# EAGLE design MURI_Compass_V3 (EAGLE 9.6.1)
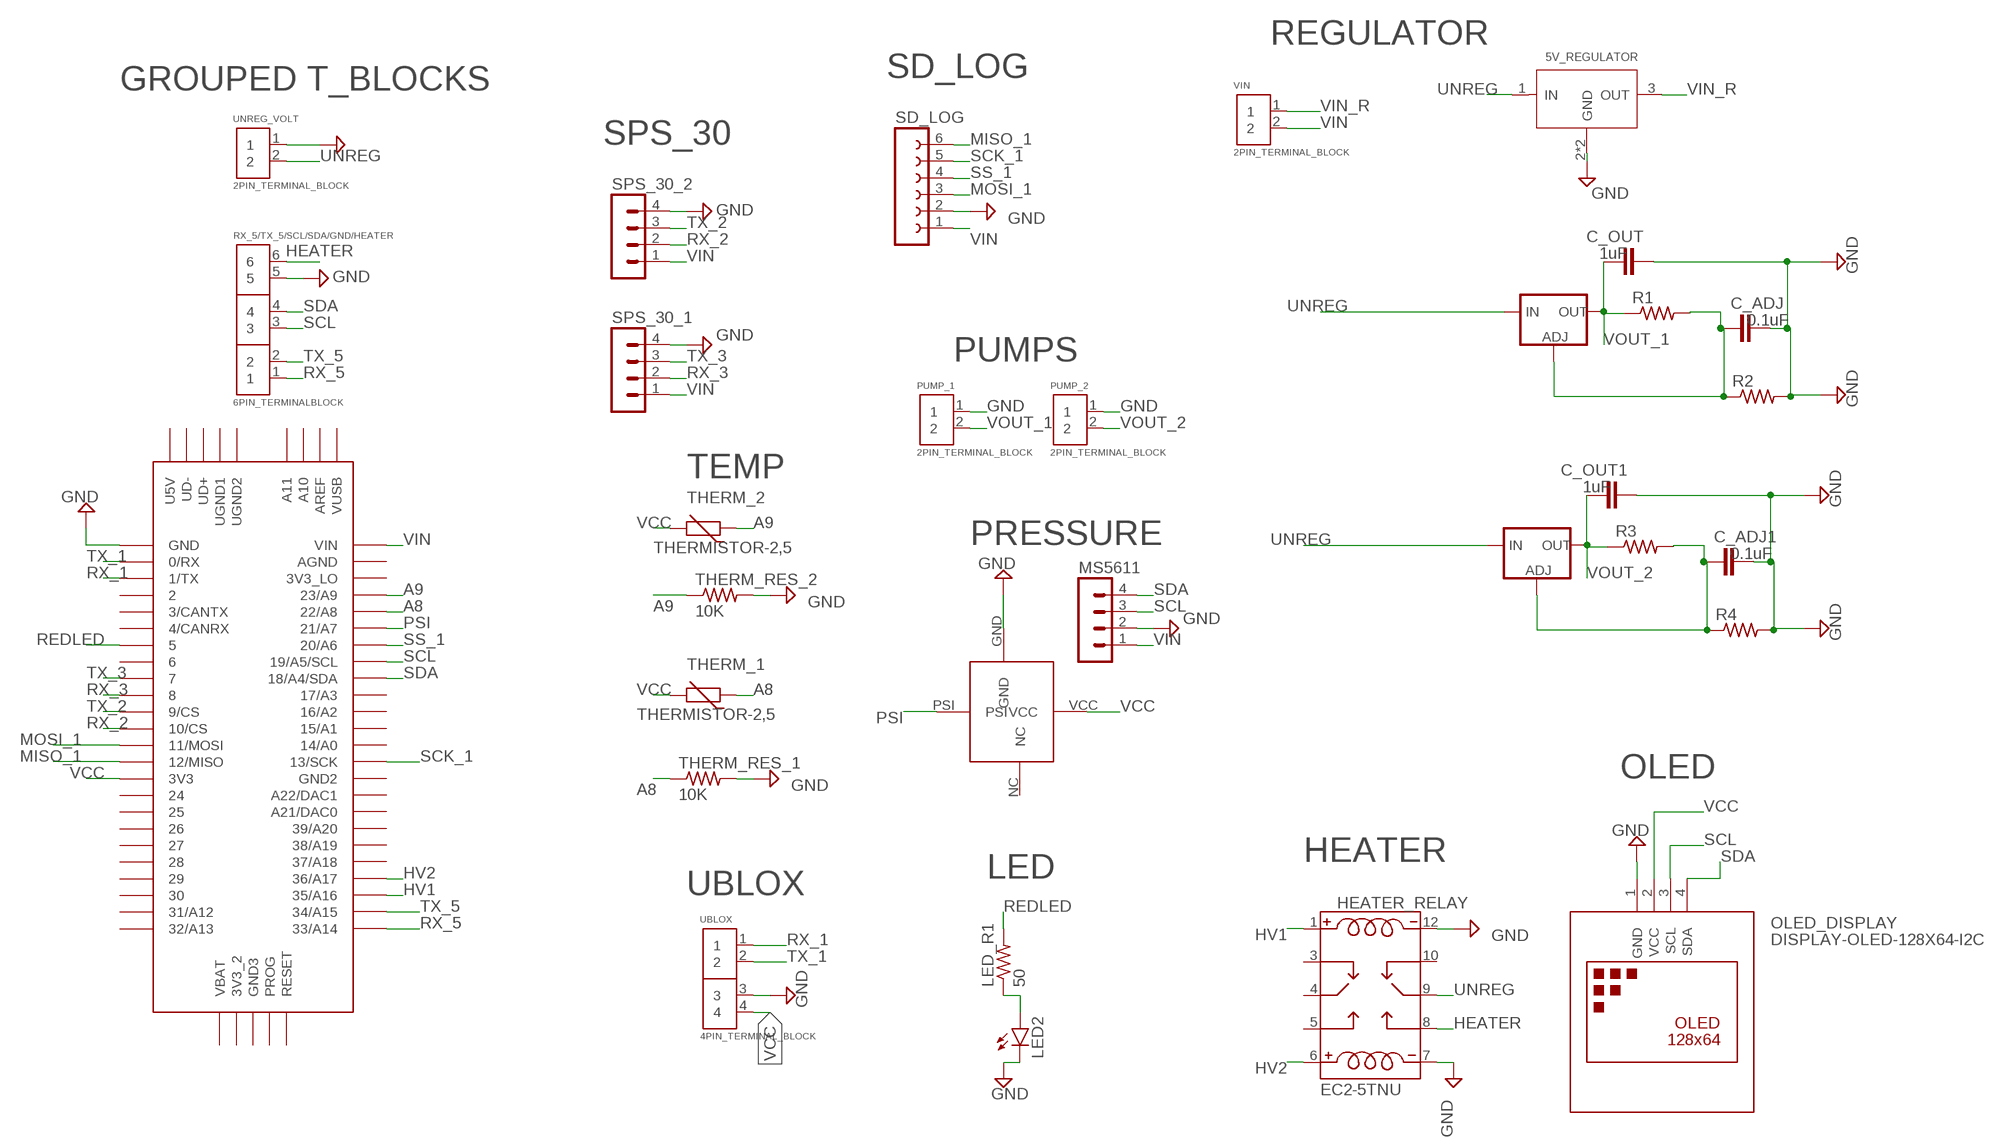
[diagram p0: schematic, sheet 1]

## Parts
5V_REGULATOR  PMIC-L7805CV-DG(TO-220)  [TO-220]
C_ADJ  0.1uF  C2,5-3  [C2.5-3]
C_ADJ1  0.1uF  C2,5-3  [C2.5-3]
C_OUT  1uF  C2,5-3  [C2.5-3]
C_OUT1  1uF  C2,5-3  [C2.5-3]
HEATER_RELAY  EC2-5TNU  [RELAY_EC2-5TNU]
LED2  TLLR4400  [LED3MM]
LED_R1  50  R-US_0204/7  [0204/7]
MS5611  MA04-1  [MA04-1]
OLED_DISPLAY  DISPLAY-OLED-128X64-I2C  [DISPLAY-OLED-128X64-I2C]
PRESSURE_SENSOR  SSCSANN015PAAA5  [SSCSANN015PAAA5]
PUMP_1  2PIN_TERMINAL_BLOCK  [2PIN_TERMINAL_BLOCK]
PUMP_2  2PIN_TERMINAL_BLOCK  [2PIN_TERMINAL_BLOCK]
R1  R-US_0204/7  [0204/7]
R2  R-US_0204/7  [0204/7]
R3  R-US_0204/7  [0204/7]
R4  R-US_0204/7  [0204/7]
RX_5/TX_5/SCL/SDA/GND/HEATER  6PIN_TERMINALBLOCK  [6PIN_TERMINALBLOCK]
SD_LOG  FE06-1  [FE06]
SPS_30_1  MA04-1  [MA04-1]
SPS_30_2  MA04-1  [MA04-1]
THERM_1  THERMISTOR-2,5  [RS-2,5]
THERM_2  THERMISTOR-2,5  [RS-2,5]
THERM_RES_1  10K  R-US_0204/7  [0204/7]
THERM_RES_2  10K  R-US_0204/7  [0204/7]
U1  V_REG_317SINK  [TO220-ADJ]
U2  V_REG_317SINK  [TO220-ADJ]
U$1  TEENSY_3.5/3.6  [TEENSY_3.5/3.6]
UBLOX  4PIN_TERMINAL_BLOCK  [4PIN_TERMINAL_BLOCK]
UNREG_VOLT  2PIN_TERMINAL_BLOCK  [2PIN_TERMINAL_BLOCK]
VIN  2PIN_TERMINAL_BLOCK  [2PIN_TERMINAL_BLOCK]

## Nets
A8: THERM_1.1 THERM_RES_1.1 U$1.22/A8
A9: THERM_2.1 THERM_RES_2.1 U$1.23/A9
GND [5V_Relay]: 5V_REGULATOR.2(GND) 5V_REGULATOR.HEAT(GND) C_ADJ1.1 C_ADJ.1 C_OUT1.2 C_OUT.2 HEATER_RELAY.7(C4) HEATER_RELAY.12(C2) LED2.K(C) MS5611.2 OLED_DISPLAY.1(GND) PRESSURE_SENSOR.GND PUMP_1.1 PUMP_2.1 R2.2 R4.2 RX_5/TX_5/SCL/SDA/GND/HEATER.5 SD_LOG.2 SPS_30_1.4 SPS_30_2.4 THERM_RES_1.2 THERM_RES_2.2 U$1.GND UBLOX.3 UNREG_VOLT.1
HEATER: HEATER_RELAY.8(NO) RX_5/TX_5/SCL/SDA/GND/HEATER.6
HV1 [5V_Relay]: HEATER_RELAY.1(C1) U$1.35/A16
HV2 [5V_Relay]: HEATER_RELAY.6(C3) U$1.36/A17
MISO_1: SD_LOG.6 U$1.12/MISO
MOSI_1: SD_LOG.3 U$1.11/MOSI
N$1: C_ADJ1.2 R3.2 R4.1 U2.ADJ
N$4: LED2.A LED_R1.1
N$6: C_ADJ.2 R1.2 R2.1 U1.ADJ
PSI: PRESSURE_SENSOR.PSI U$1.21/A7
REDLED: LED_R1.2 U$1.5
RX_1: U$1.1/TX UBLOX.1
RX_2: SPS_30_2.2 U$1.10/CS
RX_3: SPS_30_1.2 U$1.8
RX_5: RX_5/TX_5/SCL/SDA/GND/HEATER.1 U$1.33/A14
SCK_1: SD_LOG.5 U$1.13/SCK
SCL: MS5611.3 OLED_DISPLAY.3(SCL) RX_5/TX_5/SCL/SDA/GND/HEATER.3 U$1.19/A5/SCL
SDA: MS5611.4 OLED_DISPLAY.4(SDA) RX_5/TX_5/SCL/SDA/GND/HEATER.4 U$1.18/A4/SDA
SS_1: SD_LOG.4 U$1.20/A6
TX_1: U$1.0/RX UBLOX.2
TX_2: SPS_30_2.3 U$1.9/CS
TX_3: SPS_30_1.3 U$1.7
TX_5: RX_5/TX_5/SCL/SDA/GND/HEATER.2 U$1.34/A15
UNREG: 5V_REGULATOR.1(IN) HEATER_RELAY.9(M) U1.IN U2.IN UNREG_VOLT.2
VCC: OLED_DISPLAY.2(VCC) PRESSURE_SENSOR.VCC THERM_1.2 THERM_2.2 U$1.3V3 UBLOX.4
VIN: MS5611.1 SD_LOG.1 SPS_30_1.1 SPS_30_2.1 U$1.VIN VIN.2
VIN_R: 5V_REGULATOR.3(OUT) VIN.1
VOUT_1: C_OUT.1 PUMP_1.2 R1.1 U1.OUT
VOUT_2: C_OUT1.1 PUMP_2.2 R3.1 U2.OUT
Unconnected: HEATER_RELAY.3(NC1) HEATER_RELAY.4(M1) HEATER_RELAY.5(NO1) HEATER_RELAY.10(NC) PRESSURE_SENSOR.NC U$1.2 U$1.3/CANTX U$1.3V3_2 U$1.3V3_LO U$1.4/CANRX U$1.6 U$1.14/A0 U$1.15/A1 U$1.16/A2 U$1.17/A3 U$1.21/DAC0(A21/DAC0) U$1.24 U$1.25 U$1.26 U$1.27 U$1.28 U$1.29 U$1.30 U$1.31/A12 U$1.32/A13 U$1.37/A18 U$1.38/A19 U$1.39/A20 U$1.A10 U$1.A11 U$1.A22/DAC1 U$1.AGND U$1.AREF U$1.GND2 U$1.GND3 U$1.PROG U$1.RESET U$1.U5V U$1.UD+ U$1.UD- U$1.UGND1 U$1.UGND2 U$1.VBAT U$1.VUSB

## Notes on the sheet
- REGULATOR
- SD_LOG
- GROUPED T_BLOCKS
- SPS_30
- PUMPS
- TEMP
- PRESSURE
- OLED
- HEATER
- LED
- UBLOX

## Library data of the parts
5V_REGULATOR = PMIC-L7805CV-DG_TO-220_:PMIC-L7805CV-DG(TO-220): 310030073; DESCRIPTION: Linear Voltage Regulator IC 1 Output 1.5A TO-220; DIGI-KEY_PART_NUMBER: 497-12404-ND; MF: STMicroelectronics; MP: L7805CV-DG; PACKAGE: TO-220 STMicroelectronics
C_ADJ C_ADJ1 C_OUT C_OUT1 = capacitor-wima:C: CAPACITOR naming: grid - package width
HEATER_RELAY = EC2-5TNU:EC2-5TNU: Relay; E-Mech; Latching; DPDT; Ctrl-V 5DC; 2A; 250VAC; PCB Mnt; Thru Hole; EC2/EE2 Series; AVAILABILITY: Unavailable; DESCRIPTION: Relay; E-Mech; Latching; DPDT; Ctrl-V 5DC; 2A; 250VAC; PCB Mnt; Thru Hole; EC2/EE2 Series; MF: KEMET; MP: EC2-5TNU; PACKAGE: None; PRICE: None
LED2 = led:TLLR4400: Low Current (2mA) LED 3 mm Tinted Diffused Package color RED Source: Data sheet <http://www.farnell.com/datasheets/391100.pdf>; MF: VISHAY SEMICONDUCTOR; OC_FARNELL: 1612437
LED_R1 = resistor:R-US_: RESISTOR, American symbol
MS5611 SPS_30_1 SPS_30_2 = con-lstb:MA04-1: PIN HEADER; OC_FARNELL: unknown; OC_NEWARK: unknown
OLED_DISPLAY = diy-modules:DISPLAY-OLED-128X64-I2C: 128x64 Dot Matrix OLED Module based on SSD1306 chip Variant with I2C interface More details available here: http://www.instructables.com/id/Monochrome-096-i2c-OLED-display-with-arduino-SSD13/ SSD1306 datasheet: https://cdn-shop.adafruit.com/datasheets/SSD1306.pdf Click here to find device on ebay.com <http://www.ebay.com/sch/oled+display+128x64+iic> Note: There are two variants: I2C and SPI. Search for the proper version.
PRESSURE_SENSOR = SSCSANN015PAAA5:SSCSANN015PAAA5
PUMP_1 PUMP_2 UNREG_VOLT VIN = Terminal_Block:2PIN_TERMINAL_BLOCK: Terminal block; 2.54mm; angled 90°; 0.03÷1mm2; ways: 2; 10A; H: 10mm; CENTERLINE_PITCH: 2.54 mm[.1 in]; COMMENT: 282834-2; DESCRIPTION: TERMI-BLOK PCB MOUNT, 90 2P.; DIGI-KEY_PART_NUMBER: A98333-ND; DIGI-KEY_PURCHASE_URL: https://www.digikey.com/product-detail/en/te-connectivity-amp-connectors/282834-2/A98333-ND/1150135?utm_source=snapeda&utm_medium=aggregator&utm_campaign=symbol; EU_ROHS_COMPLIANCE: Compliant with Exemptions; MF: TE Connectivity; MP: 282834-2; NUMBER_OF_POSITIONS: 2; PACKAGE: None; TE_PURCHASE_URL: https://www.te.com/usa-en/product-282834-2.html?te_bu=Cor&te_type=disp&te_campaign=seda_glo_cor-seda-global-disp-prtnr-fy19-seda-model-bom-cta_sma-317_1&elqCampaignId=32493
R1-R4 THERM_RES_1 THERM_RES_2 = rcl:R-US_: RESISTOR, American symbol; SPICEPREFIX: R
RX_5/TX_5/SCL/SDA/GND/HEATER = 6PIN_Terminal_Block:6PIN_TERMINALBLOCK
SD_LOG = con-lsta:FE06-1: FEMALE HEADER; OC_FARNELL: unknown; OC_NEWARK: unknown
THERM_1 THERM_2 = varistor:THERMISTOR: THERMISTOR
U1 U2 = SparkFun-IC-Power:V_REG_317: Voltage Regulator Standard LM317 adjustable voltage regulator. AOI (Adjust Output Input). Google 'LM317 Calculator' for easy to use app to get the two resistor values needed. 240/720 for 5V output. 240/390 for 3.3V output. Spark Fun Electronics SKU : COM-00527
U$1 = Teensy356:TEENSY_3.5/3.6: Teensy 3.5/3.6
UBLOX = 4PIN_Terminal_Block:4PIN_TERMINAL_BLOCK

## Net classes
1 5V_Relay: width 0.305 mm, drill 0.35 mm, clearance 0.127 mm

## Board
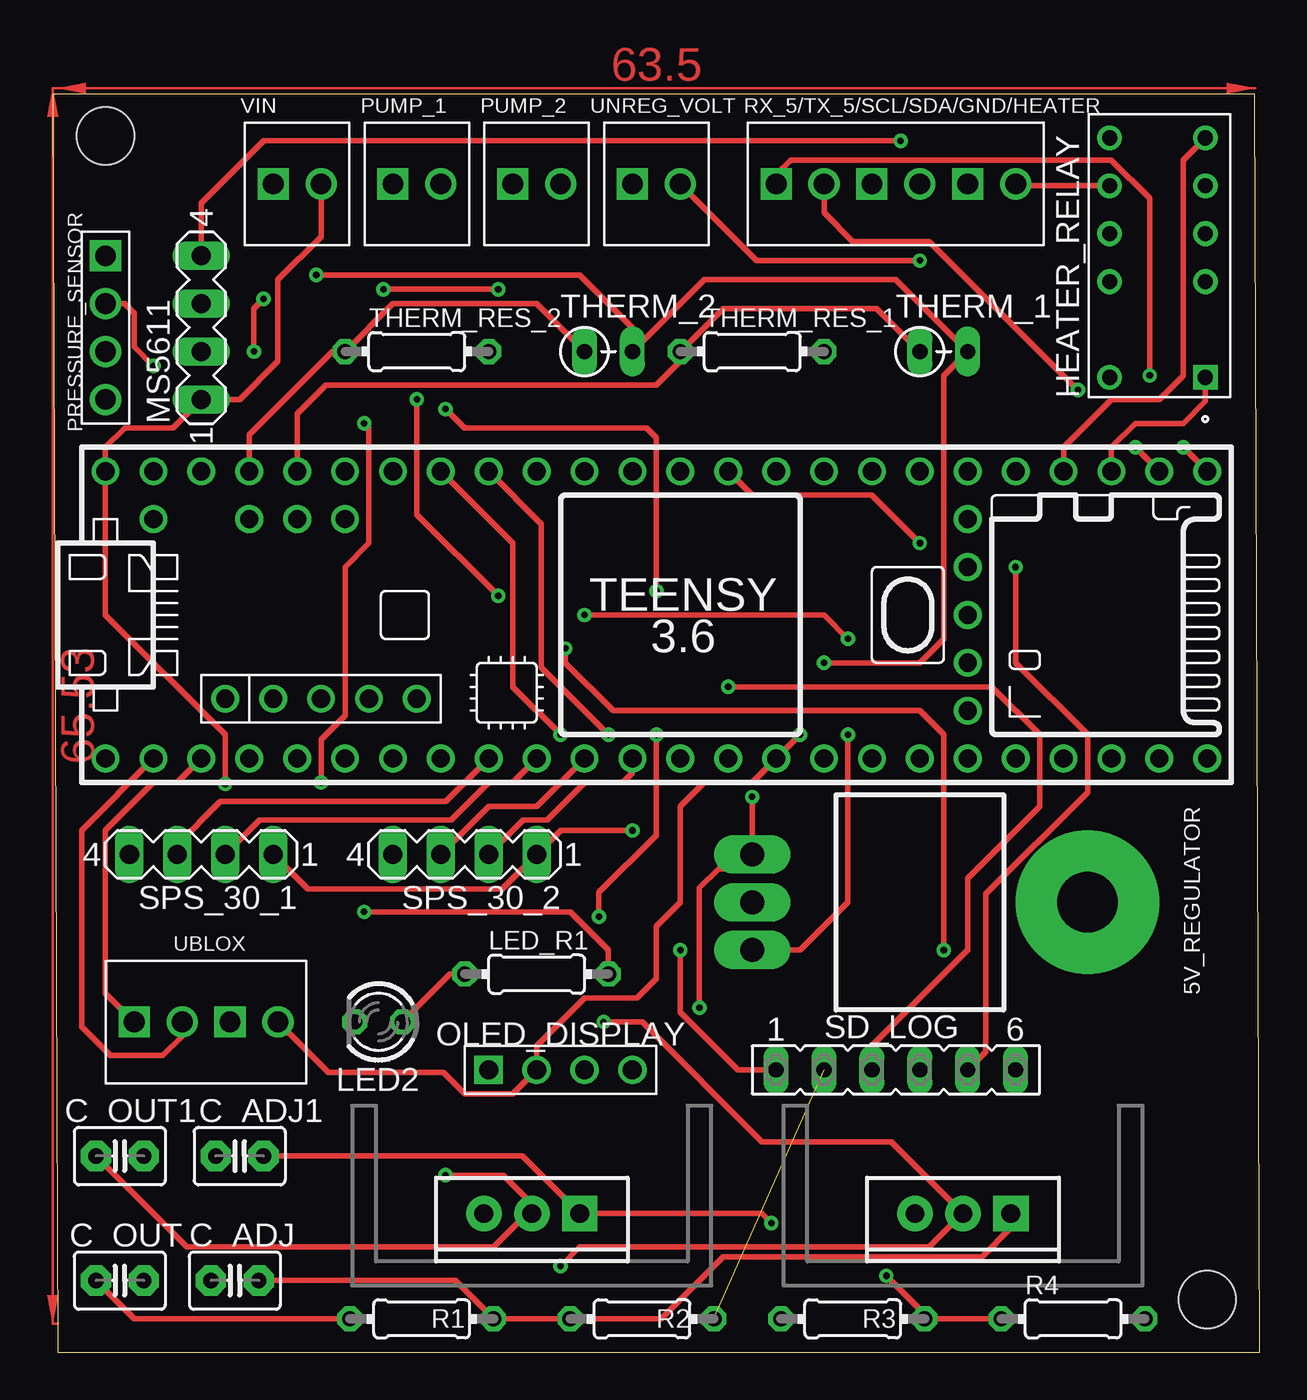
[diagram p1: board, top side]
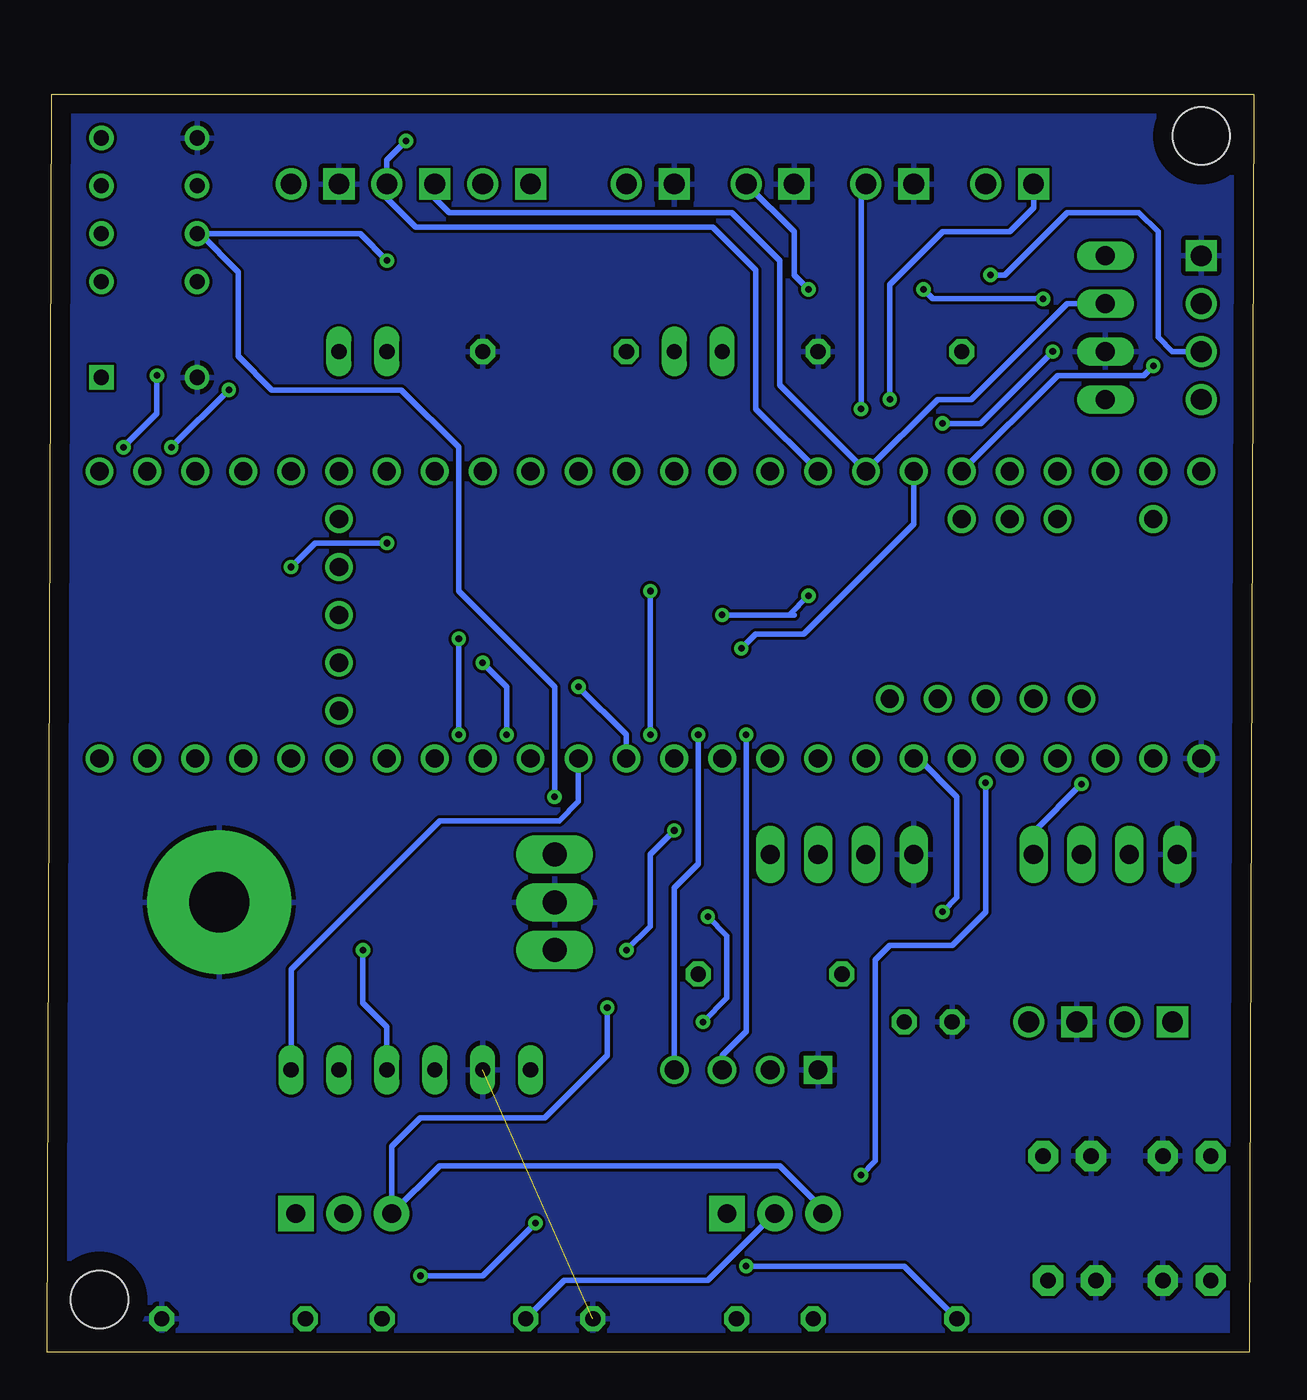
[diagram p2: board, bottom side, seen from below]

Size 63.99 x 66.73 mm. Coordinates in mm from the lower left corner, seen from the top.
Outline: 0.25,0 63.99,0 63.73,66.73 0,66.73 0.25,0
Copper layers (1*16): Top 0.035mm / dielectric 1.5mm / Bottom 0.035mm
Design rules "default": minimum track width 6mil, minimum drill 0.35mm, track to track 6mil, track to pad 6mil, pad to pad 6mil, via to via 6mil, smd to smd 6mil, copper to edge 40mil, drill to drill 6mil, minimum pad ring 10mil, minimum via ring 8mil, stop-mask expansion 4mil, vias tented up to drill 0mil, thermal gap 10mil
Holes 3.05 mm at 2.79,64.52 61.21,2.79

### Footprints (pad centres in the part's own frame; a part is rotated, then mirrored left to right if it is on the bottom)
TO-220 = drill 1.27 pad 2.032 long: 1 -2.54,-11.43; 2 0,-11.43; 3 2.54,-11.43 | drill 3.2 pad 7.62: HEAT 0,6.35
C2.5-3 = drill 0.813 pad 1.6 octagon: 1 -1.27,0; 2 1.27,0
RELAY_EC2-5TNU = drill 0.8 square: 1 -6.45,-2.44 | drill 0.8: 3 -1.37,-2.44; 4 1.17,-2.44; 5 3.71,-2.44; 6 6.25,-2.44; 7 6.25,2.64; 8 3.71,2.64; 9 1.17,2.64; 10 -1.37,2.64; 12 -6.45,2.64
LED3MM = drill 0.813 octagon: A -1.27,0; K 1.27,0
0204/7 = drill 0.813 octagon: 1 -3.81,0; 2 3.81,0
MA04-1 = drill 1.016 long: 1 -3.81,0; 2 -1.27,0; 3 1.27,0; 4 3.81,0
DISPLAY-OLED-128X64-I2C = drill 1 square: 1 -3.81,0 | drill 1: 2 -1.27,0; 3 1.27,0; 4 3.81,0
SSCSANN015PAAA5 = drill 1.1 square: GND 3.81,0 | drill 1.1: NC -3.81,0; PSI 1.27,0; VCC -1.27,0
2PIN_TERMINAL_BLOCK = drill 1.1 square: 1 -1.27,0 | drill 1.1: 2 1.27,0
6PIN_TERMINALBLOCK = drill 1.1 square: 1 -6.35,0; 3 -1.27,0; 5 3.81,0 | drill 1.1: 2 -3.81,0; 4 1.27,0; 6 6.35,0
FE06 = drill 0.813 long: 1 -6.35,0; 2 -3.81,0; 3 -1.27,0; 4 1.27,0; 5 3.81,0; 6 6.35,0
RS-2,5 = drill 0.813 long: 1 -1.27,0; 2 1.27,0
TO220-ADJ = drill 1 pad 1.88 square: ADJ -2.54,0 | drill 1 pad 1.88: IN 2.54,0; OUT 0,0
TEENSY_3.5/3.6 = drill 0.965: 0/RX -25.4,-7.62; 1/TX -22.86,-7.62; 2 -20.32,-7.62; 3/CANTX -17.78,-7.62; 3V3 7.62,-7.62; 3V3_2 17.78,-2.54; 3V3_LO -22.86,7.62; 4/CANRX -15.24,-7.62; 5 -12.7,-7.62; 6 -10.16,-7.62; 7 -7.62,-7.62; 8 -5.08,-7.62; 9/CS -2.54,-7.62; 10/CS 0,-7.62; 11/MOSI 2.54,-7.62; 12/MISO 5.08,-7.62; 13/SCK 5.08,7.62; 14/A0 2.54,7.62; 15/A1 0,7.62; 16/A2 -2.54,7.62; 17/A3 -5.08,7.62; 18/A4/SDA -7.62,7.62; 19/A5/SCL -10.16,7.62; 20/A6 -12.7,7.62; 21/A7 -15.24,7.62; 21/DAC0 12.7,7.62; 22/A8 -17.78,7.62; 23/A9 -20.32,7.62; 24 10.16,-7.62; 25 12.7,-7.62; 26 15.24,-7.62; 27 17.78,-7.62; 28 20.32,-7.62; 29 22.86,-7.62; 30 25.4,-7.62; 31/A12 27.94,-7.62; 32/A13 30.48,-7.62; 33/A14 30.48,7.62; 34/A15 27.94,7.62; 35/A16 25.4,7.62; 36/A17 22.86,7.62; 37/A18 20.32,7.62; 38/A19 17.78,7.62; 39/A20 15.24,7.62; A10 -17.78,5.08; A11 -15.24,5.08; A22/DAC1 10.16,7.62; AGND -25.4,7.62; AREF -20.32,5.08; GND -27.94,-7.62; GND2 7.62,7.62; GND3 17.78,0; PROG 17.78,2.54; RESET 17.78,5.08; U5V -21.59,-4.445; UD+ -16.51,-4.445; UD- -19.05,-4.445; UGND1 -13.97,-4.445; UGND2 -11.43,-4.445; VBAT 17.78,-5.08; VIN -27.94,7.62; VUSB -25.4,5.08
4PIN_TERMINAL_BLOCK = drill 1.1 square: 1 -3.81,0; 3 1.27,0 | drill 1.1: 2 -1.27,0; 4 3.81,0

### Placement (x,y rotation side)
5V_REGULATOR  48.51,23.88 270 top
C_ADJ  9.65,3.81 0 top
C_ADJ1  9.91,10.41 0 top
C_OUT  3.56,3.81 0 top
C_OUT1  3.56,10.41 0 top
HEATER_RELAY  58.67,58.17 90 top
LED2  17.27,17.53 180 top
LED_R1  25.65,20.07 0 top
MS5611  7.87,54.36 90 top
OLED_DISPLAY  26.92,14.99 0 top
PRESSURE_SENSOR  2.79,54.36 90 top
PUMP_1  19.3,61.98 0 top
PUMP_2  25.65,61.98 0 top
R1  19.56,1.78 0 top
R2  31.24,1.78 0 top
R3  42.42,1.78 0 top
R4  54.1,1.78 0 top
RX_5/TX_5/SCL/SDA/GND/HEATER  44.7,61.98 0 top
SD_LOG  44.7,14.99 0 top
SPS_30_1  7.87,26.42 180 top
SPS_30_2  21.84,26.42 180 top
THERM_1  47.24,53.09 0 top
THERM_2  29.46,53.09 0 top
THERM_RES_1  37.08,53.09 0 top
THERM_RES_2  19.3,53.09 0 top
U1  48.26,7.37 180 top
U2  25.4,7.37 180 top
U$1  30.73,39.12 0 top
UBLOX  8.13,17.53 0 top
UNREG_VOLT  32,61.98 0 top
VIN  12.95,61.98 0 top

### Tracks (layer width: path | path; a pad name or v marks a point on that pad's centre or on a via)
A8
  Top 0.305: THERM_1.1 43.69,55.37 35.56,55.37 THERM_RES_1.1 33.27,52.58 32,51.31 14.48,51.31 12.95,49.78 U$1.22/A8
A9
  Top 0.305: U$1.23/A9 10.41,48.69 14.81,53.09 THERM_RES_2.1 18.03,55.63 25.65,55.63 THERM_2.1
GND  (1 unrouted)
  pour Bottom: 0.25,67.06 0.25,0 63.75,0 63.75,67.06
HEATER
  Top 0.305: HEATER_RELAY.8 51.15,61.88 RX_5/TX_5/SCL/SDA/GND/HEATER.6
HV1
  Top 0.305: U$1.35/A16 56.13,48.01 57.4,49.28 59.94,49.28 61.11,50.45 HEATER_RELAY.1
HV2
  Top 0.305: U$1.36/A17 53.59,48.01 56.13,50.55 58.67,50.55 59.94,51.82 59.94,63.25 HEATER_RELAY.6
MISO_1
  Bottom 0.305: SD_LOG.6 51.05,20.32 43.18,28.19 36.83,28.19 35.81,29.21 U$1.12/MISO
MOSI_1  (via drill 0.35)
  Top 0.305: v35.81,35.31 49.78,35.31 52.32,32.77 52.32,28.96 48.51,25.15 48.51,21.34 43.43,16.26 SD_LOG.3
  Bottom 0.305: v35.81,35.31 33.27,32.77 U$1.11/MOSI
N$1  (via drill 0.35)
  Top 0.305: R4.1 R3.2 46.23,2.03 v44.2,4.06 | C_ADJ1.2 24.89,10.41 U2.ADJ 37.59,7.37 v38.1,6.86
  Bottom 0.305: v38.1,6.86 40.89,4.06 v44.2,4.06
N$4
  Top 0.305: LED2.A 21.08,20.07 LED_R1.1
N$6
  Top 0.305: C_ADJ.2 21.34,3.81 R1.2 R2.1 32.26,1.78 35.56,5.08 49.28,5.08 50.8,6.6 U1.ADJ
PSI  (via drill 0.35)
  Top 0.305: v5.33,52.32 4.32,53.34 4.32,55.12 3.81,55.63 PRESSURE_SENSOR.PSI
  Bottom 0.305: U$1.21/A7 10.41,51.82 5.84,51.82 v5.33,52.32
REDLED  (via drill 0.35)
  Top 0.305: LED_R1.2 29.46,21.34 27.43,23.37 v16.51,23.37
  Bottom 0.305: v16.51,23.37 15.75,24.13 15.75,29.46 17.78,31.5 U$1.5
RX_1
  Top 0.305: U$1.1/TX 6.6,30.23 5.33,30.23 2.79,27.69 2.79,19.05 UBLOX.1
RX_2
  Top 0.305: SPS_30_2.2 24.94,28.25 26.21,28.25 28.19,30.23 30.23,30.23 30.73,30.73 U$1.10/CS
RX_3
  Top 0.305: SPS_30_1.2 10.97,28.25 21.13,28.25 23.11,30.23 24.38,30.23 U$1.8
RX_5  (via drill 0.35)
  Top 0.305: U$1.33/A14 v59.94,48.01 | v58.17,51.82 58.17,61.21 56.13,63.25 39.12,63.25 38.35,62.48 RX_5/TX_5/SCL/SDA/GND/HEATER.1
  Bottom 0.305: v59.94,48.01 58.17,49.78 v58.17,51.82
SCK_1  (via drill 0.35)
  Top 0.305: v51.05,41.66 51.05,36.58 54.86,32.77 54.86,29.7 49.48,24.31 49.48,15.95 SD_LOG.5 | v45.97,42.93 43.43,45.47 37.08,45.47 U$1.13/SCK
  Bottom 0.305: v51.05,41.66 49.78,42.93 v45.97,42.93
SCL  (via drill 0.35)
  Top 0.305: v26.92,32.77 24.38,35.31 24.38,42.93 U$1.19/A5/SCL
  Bottom 0.305: v26.92,32.77 26.92,17.02 28.19,15.75 OLED_DISPLAY.3 | MS5611.3 9.91,55.63 14.99,50.55 16.76,50.55 U$1.19/A5/SCL 25.15,51.31 25.15,57.91 27.69,60.45 42.67,60.45 43.43,61.21 RX_5/TX_5/SCL/SDA/GND/HEATER.3
SDA  (via drill 0.35)
  Top 0.305: v29.46,32.77 25.91,36.32 25.91,43.94 U$1.18/A4/SDA | MS5611.4 7.87,60.96 11.18,64.26 v44.96,64.26
  Bottom 0.305: v29.46,32.77 29.46,25.91 30.73,24.64 OLED_DISPLAY.4 | U$1.18/A4/SDA 26.42,50.04 26.42,57.4 28.7,59.69 44.45,59.69 45.97,61.21 RX_5/TX_5/SCL/SDA/GND/HEATER.4 45.97,63.25 v44.96,64.26
SS_1  (via drill 0.35)
  Top 0.305: v47.24,21.34 47.24,32.77 45.97,34.04 29.72,34.04 27.18,36.58 v27.18,37.34
  Bottom 0.305: SD_LOG.4 45.97,17.27 47.24,18.54 v47.24,21.34 | v27.18,37.34 26.42,38.1 23.88,38.1 18.03,43.94 U$1.20/A6
TX_1
  Top 0.305: UBLOX.2 6.86,16.76 5.84,15.75 3.05,15.75 1.52,17.27 1.52,27.69 U$1.0/RX
TX_2
  Top 0.305: SPS_30_2.3 23.11,28.96 25.65,28.96 U$1.9/CS
TX_3
  Top 0.305: SPS_30_1.3 6.6,26.92 8.89,29.21 20.83,29.21 U$1.7
TX_5  (via drill 0.35)
  Top 0.305: U$1.34/A15 v57.4,48.01 | v54.36,51.05 46.48,58.93 42.42,58.93 40.89,60.45 RX_5/TX_5/SCL/SDA/GND/HEATER.2
  Bottom 0.305: v57.4,48.01 v54.36,51.05
UNREG  (via drill 0.35)
  Top 0.305: v37.08,29.46 5V_REGULATOR.1 36.32,25.65 35.31,25.65 34.29,24.64 v34.29,18.29 | UNREG_VOLT.2 37.34,57.91 v45.97,57.91
  Bottom 0.305: v37.08,29.46 37.08,35.31 42.16,40.39 42.16,48.01 45.21,51.05 52.07,51.05 53.85,52.83 53.85,57.3 55.88,59.34 | 55.88,59.34 HEATER_RELAY.9 | v45.97,57.91 47.4,59.34 55.88,59.34 | U2.IN 22.86,7.62 25.15,9.91 43.18,9.91 U1.IN 45.72,10.92 44.2,12.45 37.59,12.45 34.29,15.75 v34.29,18.29
VCC  (via drill 0.35)
  Top 0.305: v39.62,32.77 U$1.3V3 37.08,30.23 34.54,30.23 33.27,28.96 33.27,23.88 32,22.61 32,19.81 30.99,18.8 28.19,18.8 25.65,16.26 OLED_DISPLAY.2 24.38,13.72 21.84,13.72 20.7,14.86 14.61,14.86 UBLOX.4 | v40.89,36.58 45.97,36.58 47.24,37.85 47.24,51.82 THERM_1.2 44.7,56.9 34.54,56.9 THERM_2.2 30.73,54.36 27.94,57.15 v13.97,57.15
  Bottom 0.305: v39.62,32.77 39.62,35.31 v40.89,36.58 | v13.97,57.15 13.21,57.15 9.91,60.45 6.1,60.45 5.08,59.44 5.08,53.85 4.32,53.09 PRESSURE_SENSOR.VCC
VIN  (via drill 0.35)
  Top 0.305: SPS_30_1.1 13.51,24.59 23.82,24.59 SPS_30_2.1 26.92,27.69 v30.73,27.69 | v9.14,30.15 9.14,32.77 2.79,39.12 U$1.VIN 2.79,48.01 3.81,49.02 6.35,49.02 MS5611.1 9.91,50.55 11.94,52.58 11.94,56.9 14.22,59.18 VIN.2 | 38.01,14.99 SD_LOG.1 36.32,14.99 33.27,18.03 v33.27,21.34
  Bottom 0.305: v9.14,30.15 11.68,27.61 SPS_30_1.1 | v30.73,27.69 32,26.42 32,22.61 v33.27,21.34
VIN_R  (via drill 0.35)
  Top 0.305: v28.19,39.12 40.89,39.12 v42.16,37.85 | v42.16,32.77 42.16,23.88 39.62,21.34 5V_REGULATOR.3 | v23.62,40.13 19.3,44.45 v19.3,50.55
  Bottom 0.305: 24.38,39.12 24.64,39.12 | 24.64,39.12 v28.19,39.12 | v42.16,37.85 v42.16,32.77 | 24.64,39.12 v23.62,40.13 | v19.3,50.55 19.3,56.64 16.51,59.44 12.95,59.44 11.68,60.71 VIN.1
VOUT_1  (via drill 0.35)
  Top 0.305: C_OUT.1 4.32,1.78 R1.1 | v26.92,4.57 27.94,5.59 46.48,5.59 U1.OUT 44.45,11.18 37.59,11.18 31.24,17.53 v29.21,17.53 | v20.83,50.04 21.84,49.02 31.5,49.02 32,48.51 v32,40.39 | v32,32.77 32,27.43 28.96,24.38 v28.96,23.11
  Bottom 0.305: R1.1 18.54,4.57 v26.92,4.57 | PUMP_1.2 20.83,61.72 v20.83,50.04 | v32,40.39 v32,32.77 | v28.96,23.11 27.94,22.1 27.94,18.8 v29.21,17.53
VOUT_2  (via drill 0.35)
  Top 0.305: C_OUT1.1 7.11,5.59 23.37,5.59 25.15,7.37 U2.OUT 25.4,7.87 23.88,9.4 v20.83,9.4 | v14.22,30.23 14.22,32.51 15.49,33.78 15.49,41.66 16.76,42.93 16.76,49.02 v16.51,49.28 | v10.67,53.09 10.67,55.37 v11.18,55.88 | v17.53,56.39 v23.62,56.39
  Bottom 0.305: U2.OUT 28.96,3.81 36.58,3.81 R3.1 | v20.83,9.4 20.07,10.16 20.07,20.83 19.3,21.59 16,21.59 14.22,23.37 v14.22,30.23 | v16.51,49.28 14.48,49.28 v10.67,53.09 | v11.18,55.88 17.02,55.88 v17.53,56.39 | v23.62,56.39 24.38,57.15 24.38,59.44 PUMP_2.2
(copper drawn outside any net)
  shapes: Top area x2